# EAGLE schematic Bidirectional_Amp (EAGLE 9.5.1)

## Sheet 1 of 6: TX/RX Control
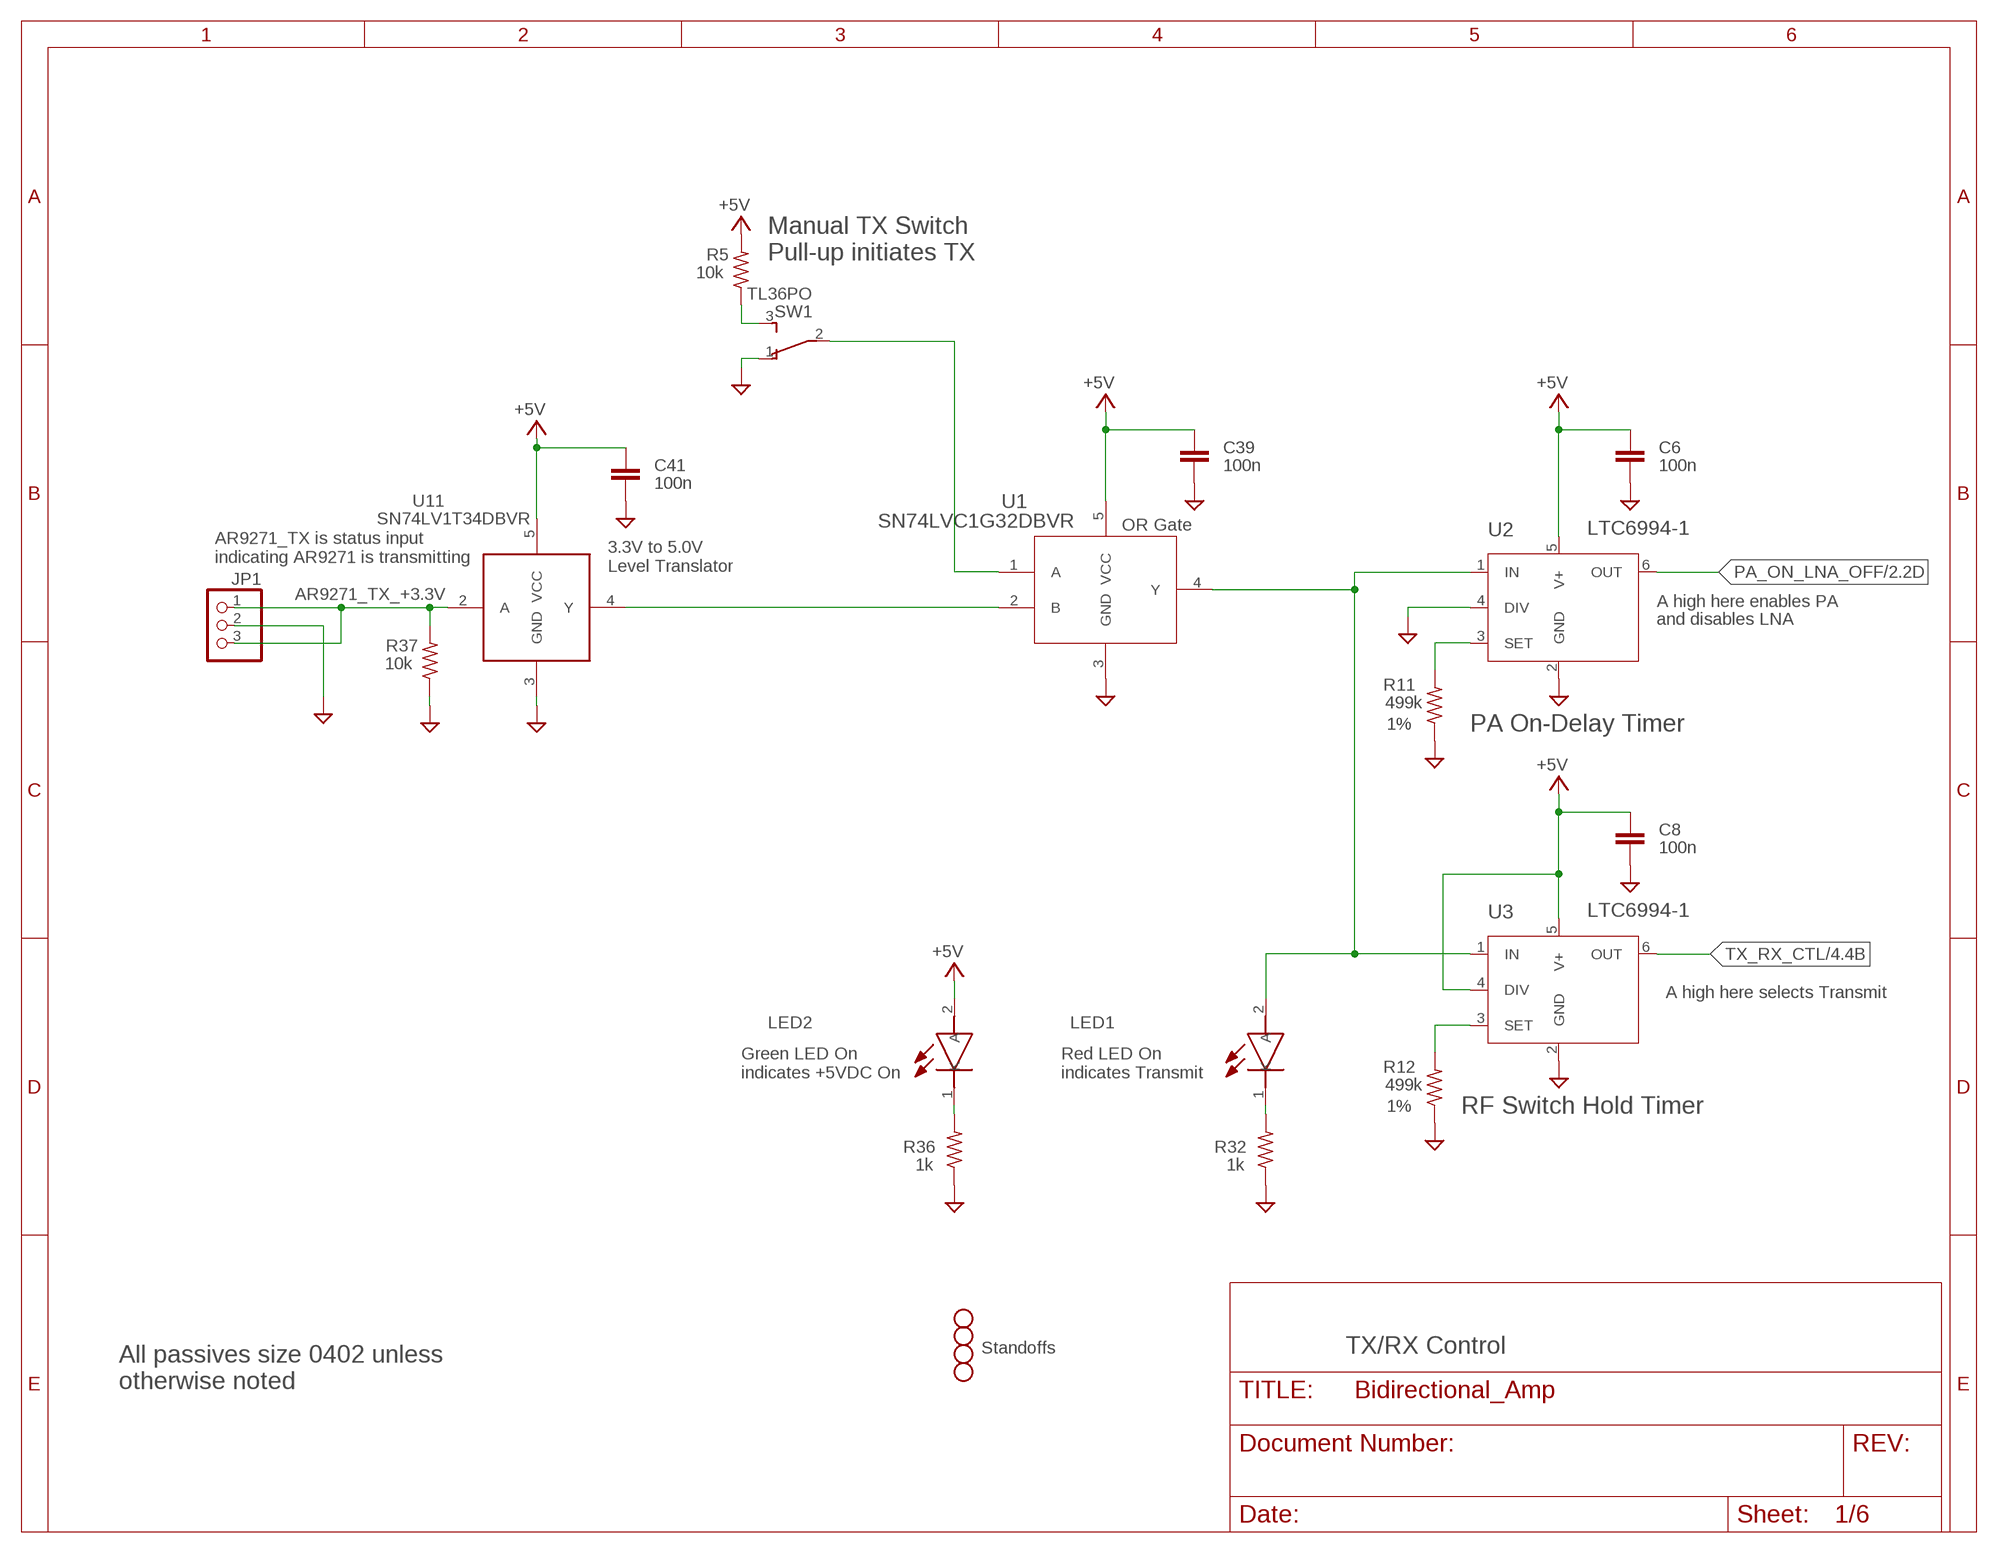
[diagram p0: schematic, sheet 1]

### Parts
C6  100n  C-EU0402-B-NOSILK  [.0402-B-NOSILK]
C8  100n  C-EU0402-B-NOSILK  [.0402-B-NOSILK]
C39  100n  C-EU0402-B-NOSILK  [.0402-B-NOSILK]
C41  100n  C-EU0402-B-NOSILK  [.0402-B-NOSILK]
H1  STAND-OFFTIGHT  [STAND-OFF-TIGHT]
H2  STAND-OFFTIGHT  [STAND-OFF-TIGHT]
H3  STAND-OFFTIGHT  [STAND-OFF-TIGHT]
H4  STAND-OFFTIGHT  [STAND-OFF-TIGHT]
JP1  PINHD-1X3  [1X03]
LED1  LTST-C193KRKT-5A  [LEDC1607X80N]
LED2  LTST-C193KGKT-5A  [LEDC1607X80N]
R5  10k  R-US_0402-B-NOSILK  [.0402-B-NOSILK]
R11  499k  R-US_0402-B-NOSILK  [.0402-B-NOSILK]
R12  499k  R-US_0402-B-NOSILK  [.0402-B-NOSILK]
R32  1k  R-US_0402-B-NOSILK  [.0402-B-NOSILK]
R36  1k  R-US_0402-B-NOSILK  [.0402-B-NOSILK]
R37  10k  R-US_0402-B-NOSILK  [.0402-B-NOSILK]
SW1  TL36PO  [TL3XPO]
U1  SN74LVC1G32DBVR  [DBV5]
U2  LTC6994-1  LTC6994CS6-1PBF  [TSOT-23_S6]
U3  LTC6994-1  LTC6994CS6-1PBF  [TSOT-23_S6]
U11  SN74LV1T34DBVR  [SOT95P280X145-5N]

### Nets
+5V: C6.1 C8.1 C39.1 C41.1 LED2.2(A) R5.2 U1.5(VCC) U2.5(V+) U3.4(DIV) U3.5(V+) U11.5(VCC) ; also sheet 2,3,4,5,6
AR9271_TX_+3.3V: JP1.1 JP1.3 R37.2 U11.2(A)
GND: C6.2 C8.2 C39.2 C41.2 JP1.2 R11.1 R12.1 R32.1 R36.1 R37.1 SW1.1(O) U1.3(GND) U2.2(GND) U2.4(DIV) U3.2(GND) U11.3(GND) ; also sheet 2,3,4,5,6
N$3: R5.1 SW1.3(S)
N$5: SW1.2(P) U1.1(A)
N$10: LED1.2(A) U1.4(Y) U2.1(IN) U3.1(IN)
N$11: R11.2 U2.3(SET)
N$13: U1.2(B) U11.4(Y)
N$14: R12.2 U3.3(SET)
N$15: LED1.1(K) R32.2
N$51: LED2.1(K) R36.2
PA_ON_LNA_OFF: U2.6(OUT) ; also sheet 2,3
TX_RX_CTL: U3.6(OUT) ; also sheet 4

### Notes on the sheet
- Manual TX Switch
  Pull-up initiates TX
- OR Gate
- AR9271_TX is status input
  indicating AR9271 is transmitting
- 3.3V to 5.0V
  Level Translator
- A high here enables PA
- and disables LNA
- 1% | PA On-Delay Timer
- A high here selects Transmit
- Green LED On
  indicates +5VDC On
- Red LED On
  indicates Transmit
- 1% | RF Switch Hold Timer
- Standoffs | TX/RX Control
- All passives size 0402 unless
  otherwise noted

## Sheet 2 of 6: Power Amplifier
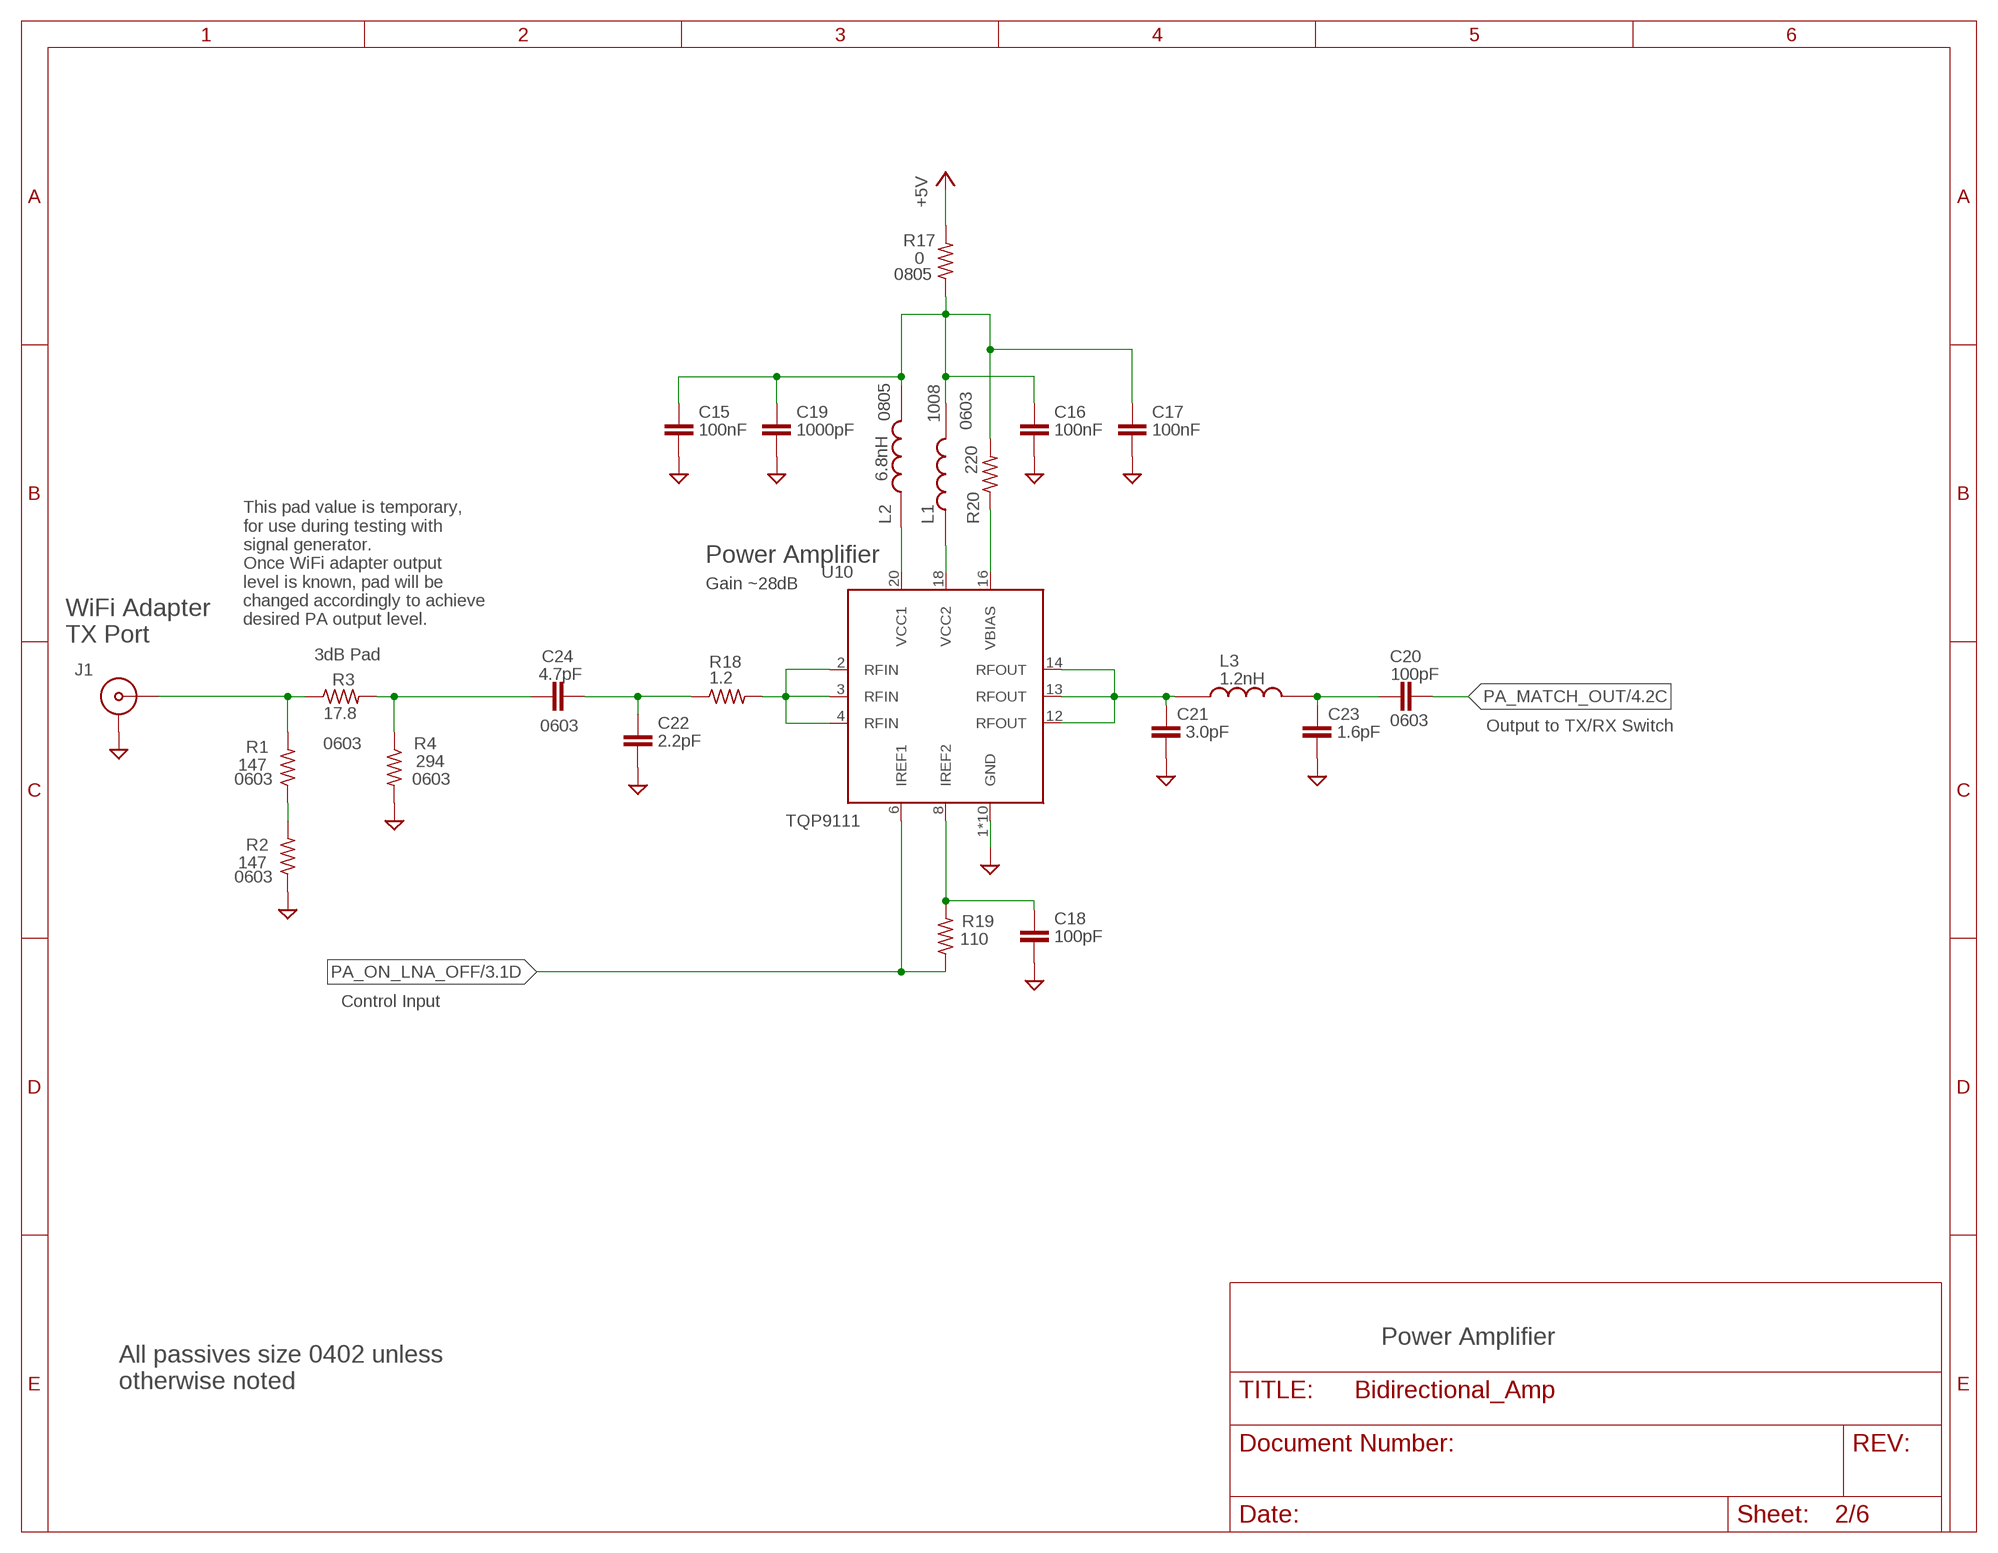
[diagram p1: schematic, sheet 2]

### Parts
C15  100nF  C-EU0402-B-NOSILK  [.0402-B-NOSILK]
C16  100nF  C-EU0402-B-NOSILK  [.0402-B-NOSILK]
C17  100nF  C-EU0402-B-NOSILK  [.0402-B-NOSILK]
C18  100pF  C-EU0402-B-NOSILK  [.0402-B-NOSILK]
C19  1000pF  C-EU0402-B-NOSILK  [.0402-B-NOSILK]
C20  100pF  C-EU0603-C-NOSILK  [.0603-C-NOSILK]
C21  3.0pF  C-EU0402-C-NOSILK  [.0402-C-NOSILK]
C22  2.2pF  C-EU0402-C-NOSILK  [.0402-C-NOSILK]
C23  1.6pF  C-EU0402-C-NOSILK  [.0402-C-NOSILK]
C24  4.7pF  C-EU0603-C-NOSILK  [.0603-C-NOSILK]
J1  142-0701-851_ALT  [142-0701-851]
L1  1008HQ-10NXJLB1008_IMPERIAL_2520_METRIC  [INDC2520X120N]
L2  6.8nH  0805CS-060XJLC  [0805CS]
L3  1.2nH  0402CS-1N2XJLW  [0402CS1N2XJLW]
R1  147  R-US_0603-C-NOSILK  [.0603-C-NOSILK]
R2  147  R-US_0603-C-NOSILK  [.0603-C-NOSILK]
R3  17.8  R-US_0603-C-NOSILK  [.0603-C-NOSILK]
R4  294  R-US_0603-C-NOSILK  [.0603-C-NOSILK]
R17  0  R-US_R0805  [R0805]
R18  1.2  R-US_R0402  [R0402]
R19  110  R-US_0402-B-NOSILK  [.0402-B-NOSILK]
R20  220  R-US_0603-C-NOSILK  [.0603-C-NOSILK]
U10  TQP9111  [QFN50P400X400X102-21N]

### Nets
+5V: R17.2 ; also sheet 1,3,4,5,6
GND: C15.2 C16.2 C17.2 C18.2 C19.2 C21.2 C22.2 C23.2 J1.GND1(GND) J1.GND2(GND) J1.GND3(GND) J1.GND4(GND) R2.1 R4.2 U10.1(GND) U10.5(GND) U10.7(GND) U10.9(GND) U10.10(GND) U10.11(GND) U10.15(GND) U10.17(GND) U10.19(GND) U10.21(GND) ; also sheet 1,3,4,5,6
N$2 [RF]: J1.RF1(CTR) R1.2 R3.1
N$4: R1.1 R2.2
N$16: L1.1 U10.18(VCC2)
N$21: C15.1 C16.1 C17.1 C19.1 L1.2 L2.2 R17.1 R20.2
N$22: C18.1 R19.2 U10.8(IREF2)
N$24 [RF]: C21.1 L3.1 U10.12(RFOUT) U10.13(RFOUT) U10.14(RFOUT)
N$25 [RF]: C22.1 C24.2 R18.1
N$27 [RF]: C20.1 C23.1 L3.2
N$30: R20.1 U10.16(VBIAS)
N$31: L2.1 U10.20(VCC1)
N$56 [RF]: R18.2 U10.2(RFIN) U10.3(RFIN) U10.4(RFIN)
PA_MATCH_OUT [RF]: C20.2 ; also sheet 4
PA_ON_LNA_OFF: R19.1 U10.6(IREF1) ; also sheet 1,3
PA_PAD_OUT [RF]: C24.1 R3.2 R4.1

### Notes on the sheet
- 0805
- 0805 | 1008
- 0603
- Power Amplifier
- Gain ~28dB
- This pad value is temporary,
  for use during testing with
  signal generator.
  Once WiFi adapter output
  level is known, pad will be
  changed accordingly to achieve
  desired PA output level.
- WiFi Adapter
  TX Port
- 3dB Pad
- 0603
- 0603 | Output to TX/RX Switch
- 0603
- 0603 | 0603
- 0603
- Control Input
- Power Amplifier
- All passives size 0402 unless
  otherwise noted

## Sheet 3 of 6: LNA and RX Bandpass Filters
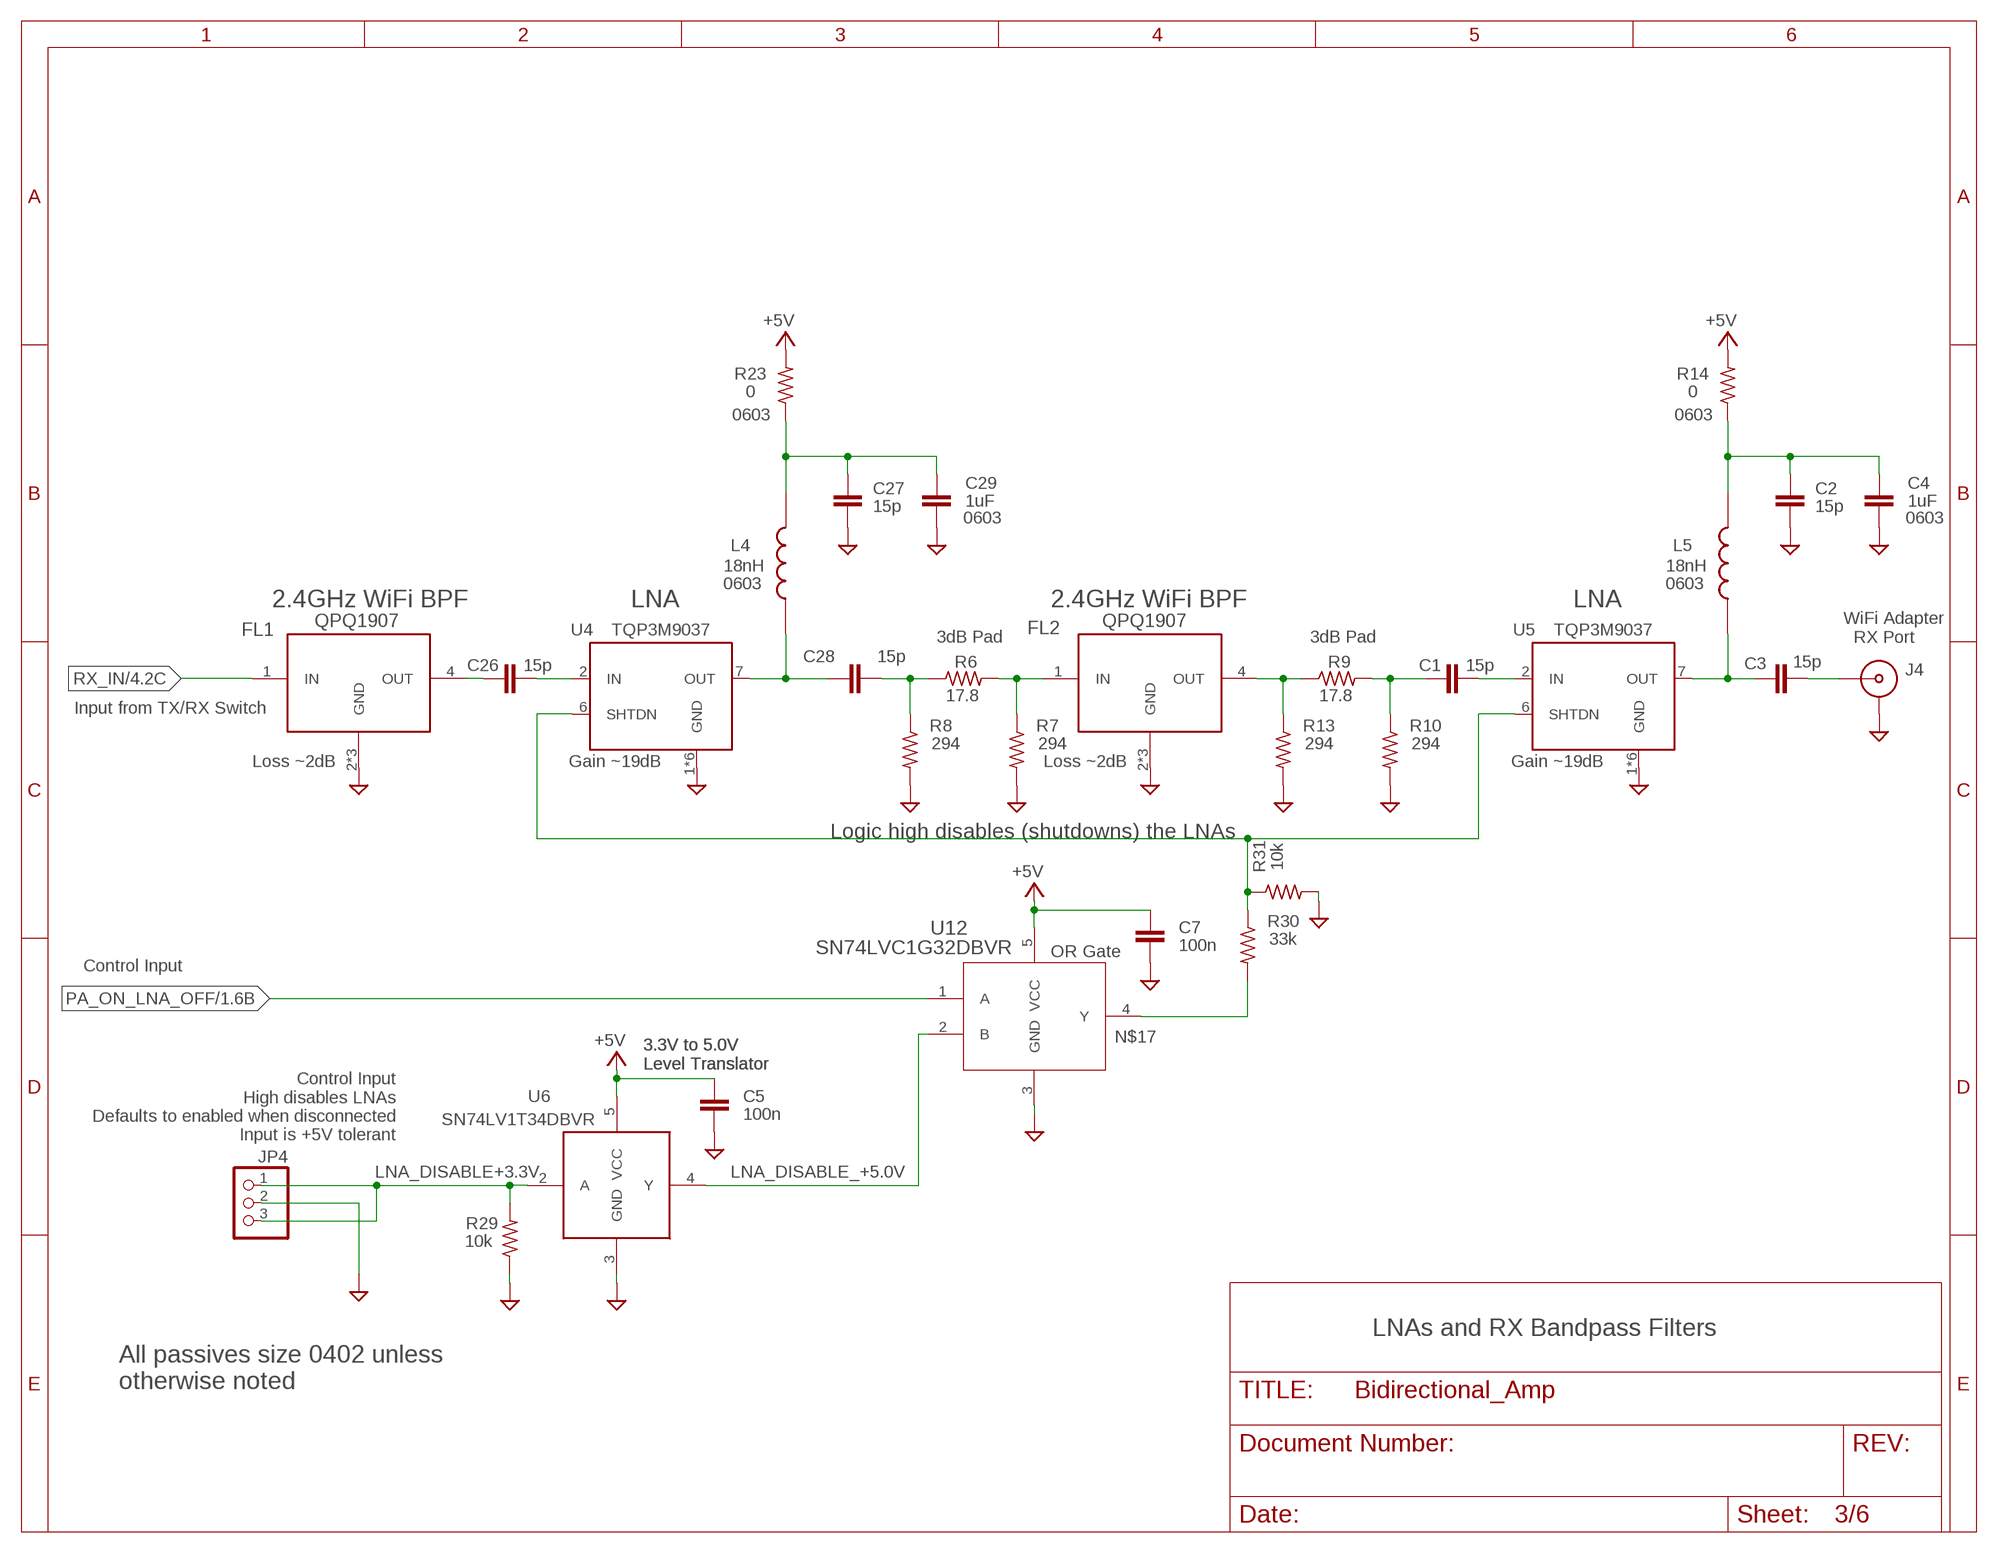
[diagram p2: schematic, sheet 3]

### Parts
C1  15p  C-EU0402-C-NOSILK  [.0402-C-NOSILK]
C2  15p  C-EU0402-B-NOSILK  [.0402-B-NOSILK]
C3  15p  C-EU0402-C-NOSILK  [.0402-C-NOSILK]
C4  1uF  C-EU0603-B-NOSILK  [.0603-B-NOSILK]
C5  100n  C-EU0402-B-NOSILK  [.0402-B-NOSILK]
C7  100n  C-EU0402-B-NOSILK  [.0402-B-NOSILK]
C26  15p  C-EU0402-C-NOSILK  [.0402-C-NOSILK]
C27  15p  C-EU0402-B-NOSILK  [.0402-B-NOSILK]
C28  15p  C-EU0402-C-NOSILK  [.0402-C-NOSILK]
C29  1uF  C-EU0603-B-NOSILK  [.0603-B-NOSILK]
FL1  QPQ1907  [FIL_B39162B9417K610]
FL2  QPQ1907  [FIL_B39162B9417K610]
J4  142-0701-851_ALT  [142-0701-851]
JP4  PINHD-1X3  [1X03]
L4  68nH  0603CS-68NXJLW  [0603CS-68NXJLW]
L5  68nH  0603CS-68NXJLW  [0603CS-68NXJLW]
R6  17.8  R-US_0402-C-NOSILK  [.0402-C-NOSILK]
R7  294  R-US_0402-C-NOSILK  [.0402-C-NOSILK]
R8  294  R-US_0402-C-NOSILK  [.0402-C-NOSILK]
R9  17.8  R-US_0402-C-NOSILK  [.0402-C-NOSILK]
R10  294  R-US_0402-C-NOSILK  [.0402-C-NOSILK]
R13  294  R-US_0402-C-NOSILK  [.0402-C-NOSILK]
R14  0  R-US_0603-B-NOSILK  [.0603-B-NOSILK]
R23  0  R-US_0603-B-NOSILK  [.0603-B-NOSILK]
R29  10k  R-US_0402-B-NOSILK  [.0402-B-NOSILK]
R30  33k  R-US_0402-B-NOSILK  [.0402-B-NOSILK]
R31  10k  R-US_0402-B-NOSILK  [.0402-B-NOSILK]
U4  TQP3M9037  TQP3M903X  [DFN8-2X2-WITH-PAD]
U5  TQP3M9037  TQP3M903X  [DFN8-2X2-WITH-PAD]
U6  SN74LV1T34DBVR  [SOT95P280X145-5N]
U12  SN74LVC1G32DBVR  [DBV5]

### Nets
+5V: C5.1 C7.1 R14.2 R23.2 U6.5(VCC) U12.5(VCC) ; also sheet 1,2,4,5,6
GND: C2.1 C4.2 C5.2 C7.2 C27.1 C29.2 FL1.2(GND) FL1.3(GND) FL1.5(GND) FL2.2(GND) FL2.3(GND) FL2.5(GND) J4.GND1(GND) J4.GND2(GND) J4.GND3(GND) J4.GND4(GND) JP4.2 R7.2 R8.2 R10.2 R13.2 R29.1 R31.2 U4.1(GND) U4.3(GND) U4.4(GND) U4.5(GND) U4.8(GND) U4.PAD(GND) U5.1(GND) U5.3(GND) U5.4(GND) U5.5(GND) U5.8(GND) U5.PAD(GND) U6.3(GND) U12.3(GND) ; also sheet 1,2,4,5,6
LNA_DISABLE+3.3V: JP4.1 JP4.3 R29.2 U6.2(A)
LNA_DISABLE_+5.0V: U6.4(Y) U12.2(B)
LNA_ON_OFF: R30.1 R31.1 U4.6(SHTDN) U5.6(SHTDN)
N$1 [RF]: C28.2 R6.1 R8.1
N$6 [RF]: FL2.4(OUT) R9.1 R13.1
N$7 [RF]: C1.2 U5.2(IN)
N$8 [RF]: C3.1 L5.1 U5.7(OUT)
N$9: C2.2 C4.1 L5.2 R14.1
N$12 [RF]: C3.2 J4.RF1(CTR)
N$17: R30.2 U12.4(Y)
N$26 [RF]: C26.2 U4.2(IN)
N$28 [RF]: C28.1 L4.1 U4.7(OUT)
N$29: C27.2 C29.1 L4.2 R23.1
N$33 [RF]: C26.1 FL1.4(OUT)
PA_ON_LNA_OFF: U12.1(A) ; also sheet 1,2
PA_PAD_OUT1 [RF]: FL2.1(IN) R6.2 R7.1
PA_PAD_OUT2 [RF]: C1.1 R9.2 R10.1
RX_IN [RF]: FL1.1(IN) ; also sheet 4

### Notes on the sheet
- 0603 | 0603
- 0603 | 0603
- 18nH | 18nH
- 0603 | 0603
- 2.4GHz WiFi BPF | LNA | 2.4GHz WiFi BPF | LNA
- 3dB Pad | 3dB Pad
- WiFi Adapter
    RX Port
- Input from TX/RX Switch
- Loss ~2dB | Gain ~19dB | Loss ~2dB | Gain ~19dB
- Logic high disables (shutdowns) the LNAs
- OR Gate
- Control Input
- 3.3V to 5.0V
  Level Translator
- 3.3V to 5.0V
  Level Translator
- Control Input
  High disables LNAs
  Defaults to enabled when disconnected
  Input is +5V tolerant
- LNAs and RX Bandpass Filters
- All passives size 0402 unless
  otherwise noted

## Sheet 4 of 6: TX/RX Switch
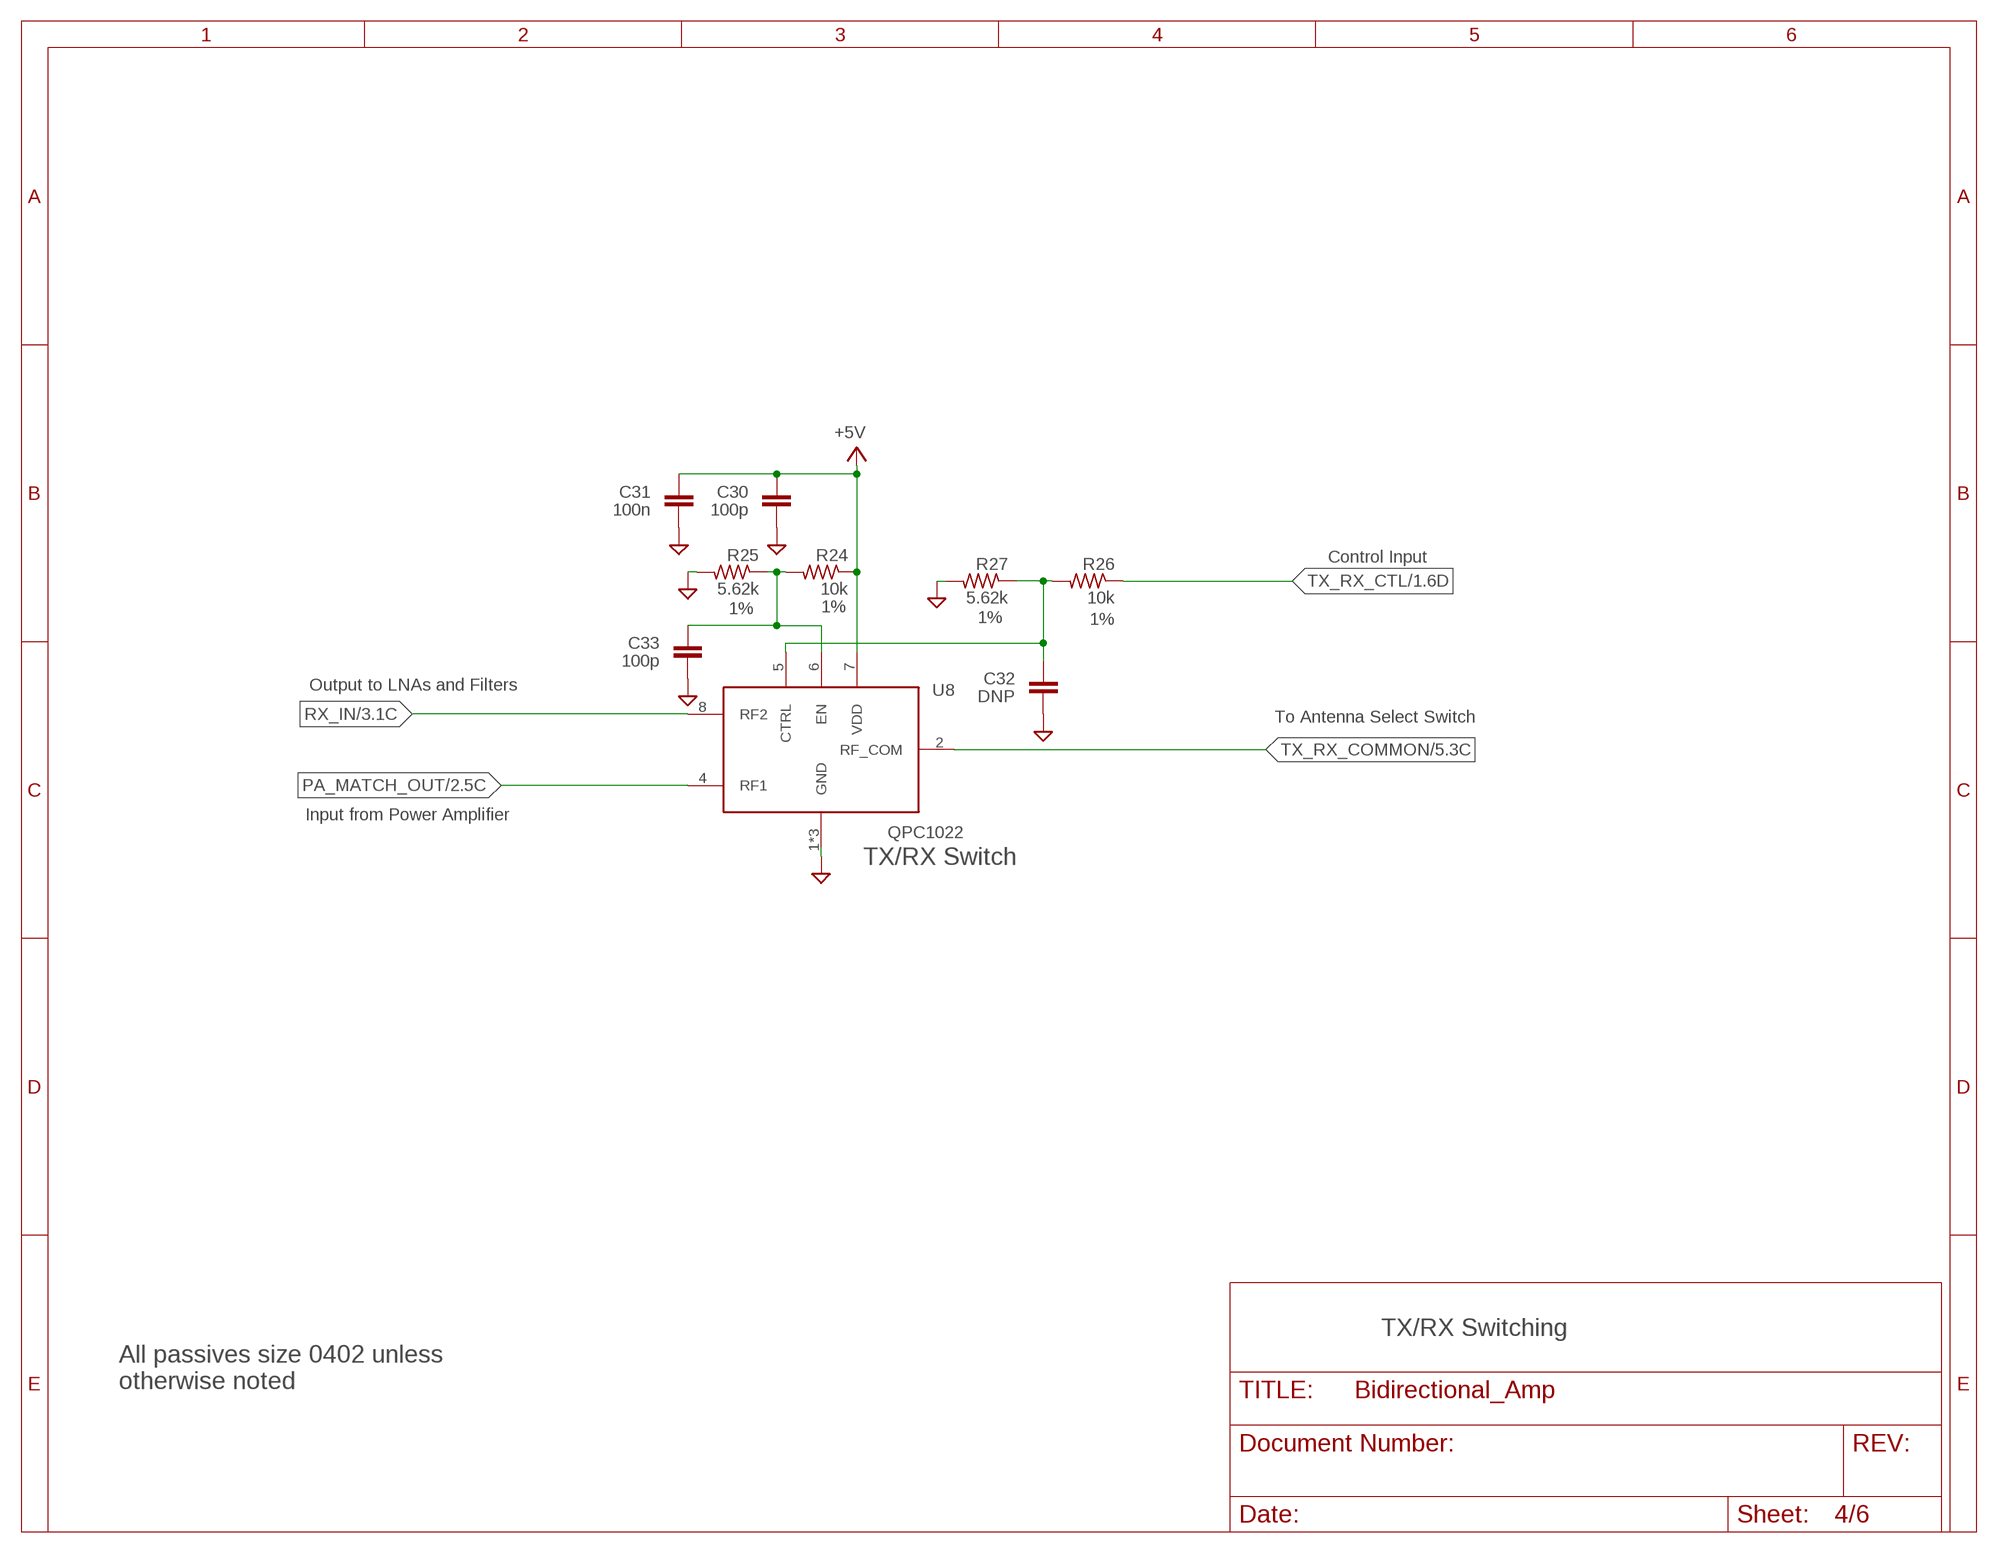
[diagram p3: schematic, sheet 4]

### Parts
C30  100p  C-EU0402-B-NOSILK  [.0402-B-NOSILK]
C31  100n  C-EU0402-B-NOSILK  [.0402-B-NOSILK]
C32  DNP  C-EU0402-B-NOSILK  [.0402-B-NOSILK]
C33  100p  C-EU0402-B-NOSILK  [.0402-B-NOSILK]
R24  10k  R-US_0402-B-NOSILK  [.0402-B-NOSILK]
R25  5.62k  R-US_0402-B-NOSILK  [.0402-B-NOSILK]
R26  10k  R-US_0402-B-NOSILK  [.0402-B-NOSILK]
R27  5.62k  R-US_0402-B-NOSILK  [.0402-B-NOSILK]
U8  QPC1022  [QPC1022]

### Nets
+5V: C30.1 C31.1 R24.1 U8.7(VDD) ; also sheet 1,2,3,5,6
GND: C30.2 C31.2 C32.2 C33.2 R25.2 R27.2 U8.1(GND) U8.3(GND) U8.9(GND) ; also sheet 1,2,3,5,6
PA_MATCH_OUT [RF]: U8.4(RF1) ; also sheet 2
RX_IN [RF]: U8.8(RF2) ; also sheet 3
TX_RX_COMMON [RF]: U8.2(RF_COM) ; also sheet 5
TX_RX_CTL: R26.1 ; also sheet 1
TXRX-CTRL: C32.1 R26.2 R27.1 U8.5(CTRL)
TXRX-EN: C33.1 R24.2 R25.1 U8.6(EN)

### Notes on the sheet
- Control Input
- 1% | 1%
- 1% | 1%
- Output to LNAs and Filters
- To Antenna Select Switch
- Input from Power Amplifier
- TX/RX Switch
- TX/RX Switching
- All passives size 0402 unless
  otherwise noted

## Sheet 5 of 6: Antenna Select Switch
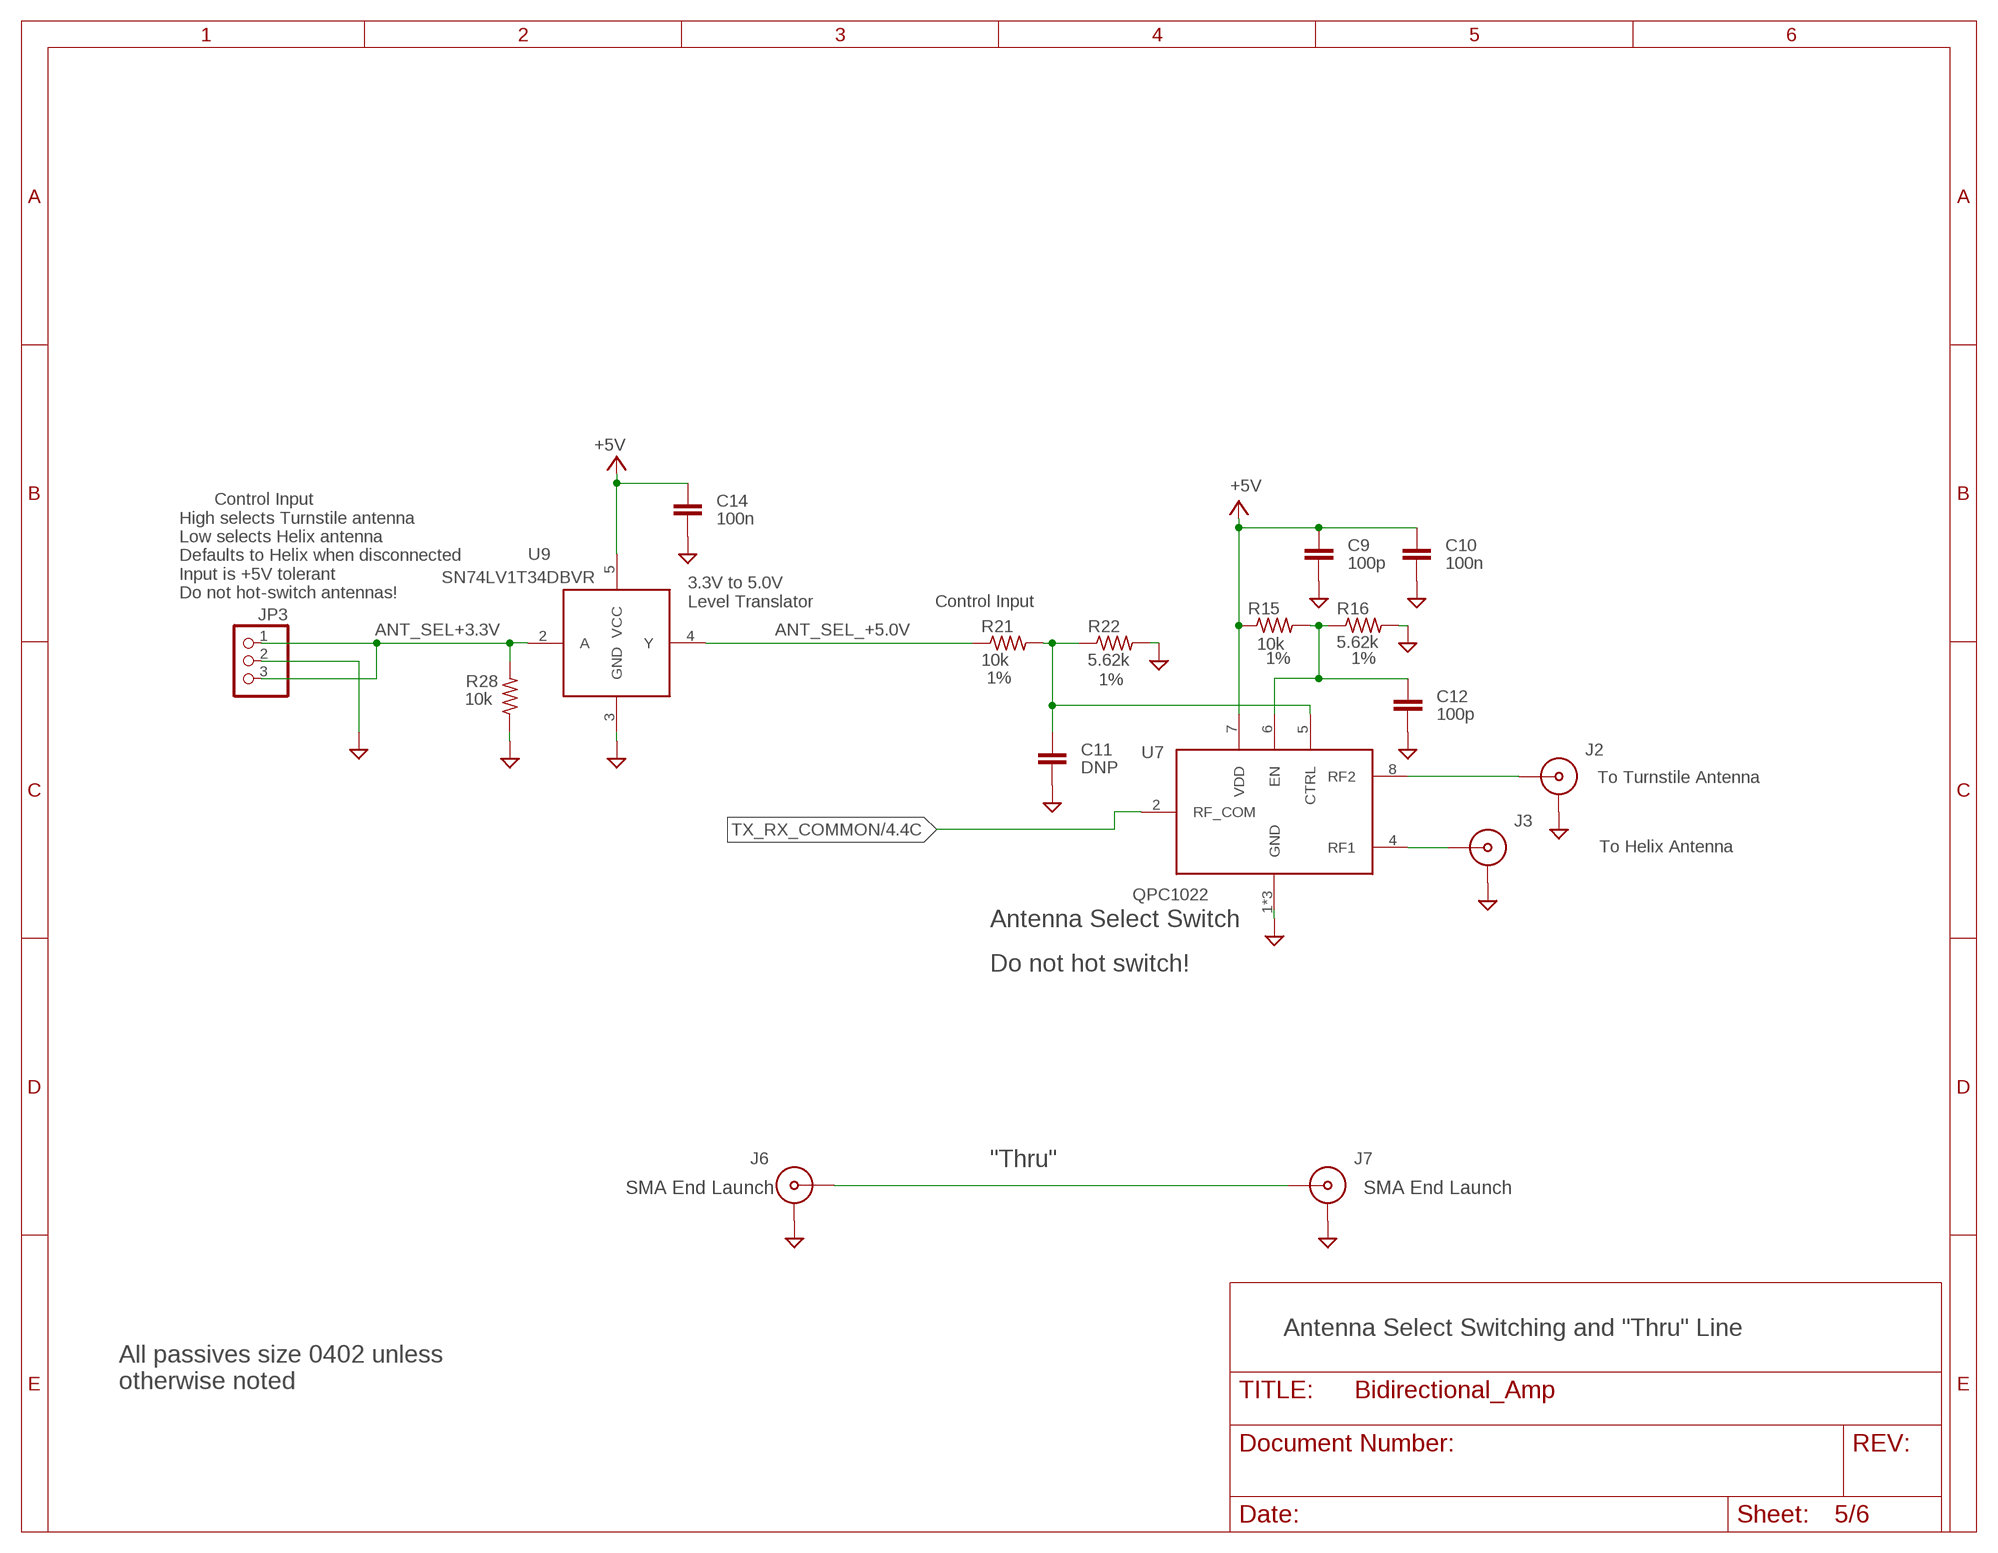
[diagram p4: schematic, sheet 5]

### Parts
C9  100p  C-EU0402-B-NOSILK  [.0402-B-NOSILK]
C10  100n  C-EU0402-B-NOSILK  [.0402-B-NOSILK]
C11  DNP  C-EU0402-B-NOSILK  [.0402-B-NOSILK]
C12  100p  C-EU0402-B-NOSILK  [.0402-B-NOSILK]
C14  100n  C-EU0402-B-NOSILK  [.0402-B-NOSILK]
J2  142-0701-851_ALT  [142-0701-851]
J3  142-0701-851_ALT  [142-0701-851]
J6  142-0701-851_ALT  [142-0701-851]
J7  142-0701-851_ALT  [142-0701-851]
JP3  PINHD-1X3  [1X03]
R15  10k  R-US_0402-B-NOSILK  [.0402-B-NOSILK]
R16  5.62k  R-US_0402-B-NOSILK  [.0402-B-NOSILK]
R21  10k  R-US_0402-B-NOSILK  [.0402-B-NOSILK]
R22  5.62k  R-US_0402-B-NOSILK  [.0402-B-NOSILK]
R28  10k  R-US_0402-B-NOSILK  [.0402-B-NOSILK]
U7  QPC1022  [QPC1022]
U9  SN74LV1T34DBVR  [SOT95P280X145-5N]

### Nets
+5V: C9.1 C10.1 C14.1 R15.1 U7.7(VDD) U9.5(VCC) ; also sheet 1,2,3,4,6
ANT_SEL+3.3V: JP3.1 JP3.3 R28.2 U9.2(A)
ANT_SEL_+5.0V: R21.1 U9.4(Y)
AS-CTRL: C11.1 R21.2 R22.1 U7.5(CTRL)
AS-EN: C12.1 R15.2 R16.1 U7.6(EN)
GND: C9.2 C10.2 C11.2 C12.2 C14.2 J2.GND1(GND) J2.GND2(GND) J2.GND3(GND) J2.GND4(GND) J3.GND1(GND) J3.GND2(GND) J3.GND3(GND) J3.GND4(GND) J6.GND1(GND) J6.GND2(GND) J6.GND3(GND) J6.GND4(GND) J7.GND1(GND) J7.GND2(GND) J7.GND3(GND) J7.GND4(GND) JP3.2 R16.2 R22.2 R28.1 U7.1(GND) U7.3(GND) U7.9(GND) U9.3(GND) ; also sheet 1,2,3,4,6
HELICAL [RF]: J2.RF1(CTR) U7.8(RF2)
THROUGH [RF]: J6.RF1(CTR) J7.RF1(CTR)
TURNSTILE [RF]: J3.RF1(CTR) U7.4(RF1)
TX_RX_COMMON [RF]: U7.2(RF_COM) ; also sheet 4

### Notes on the sheet
- Control Input
  High selects Turnstile antenna
  Low selects Helix antenna
  Defaults to Helix when disconnected
  Input is +5V tolerant
  Do not hot-switch antennas!
- 3.3V to 5.0V
  Level Translator
- Control Input
- 1% | 1%
- 1% | 1%
- To Turnstile Antenna
- To Helix Antenna
- Antenna Select Switch
- Do not hot switch!
- "Thru"
- SMA End Launch | SMA End Launch
- Antenna Select Switching and "Thru" Line
- All passives size 0402 unless
  otherwise noted

## Sheet 6 of 6: Power
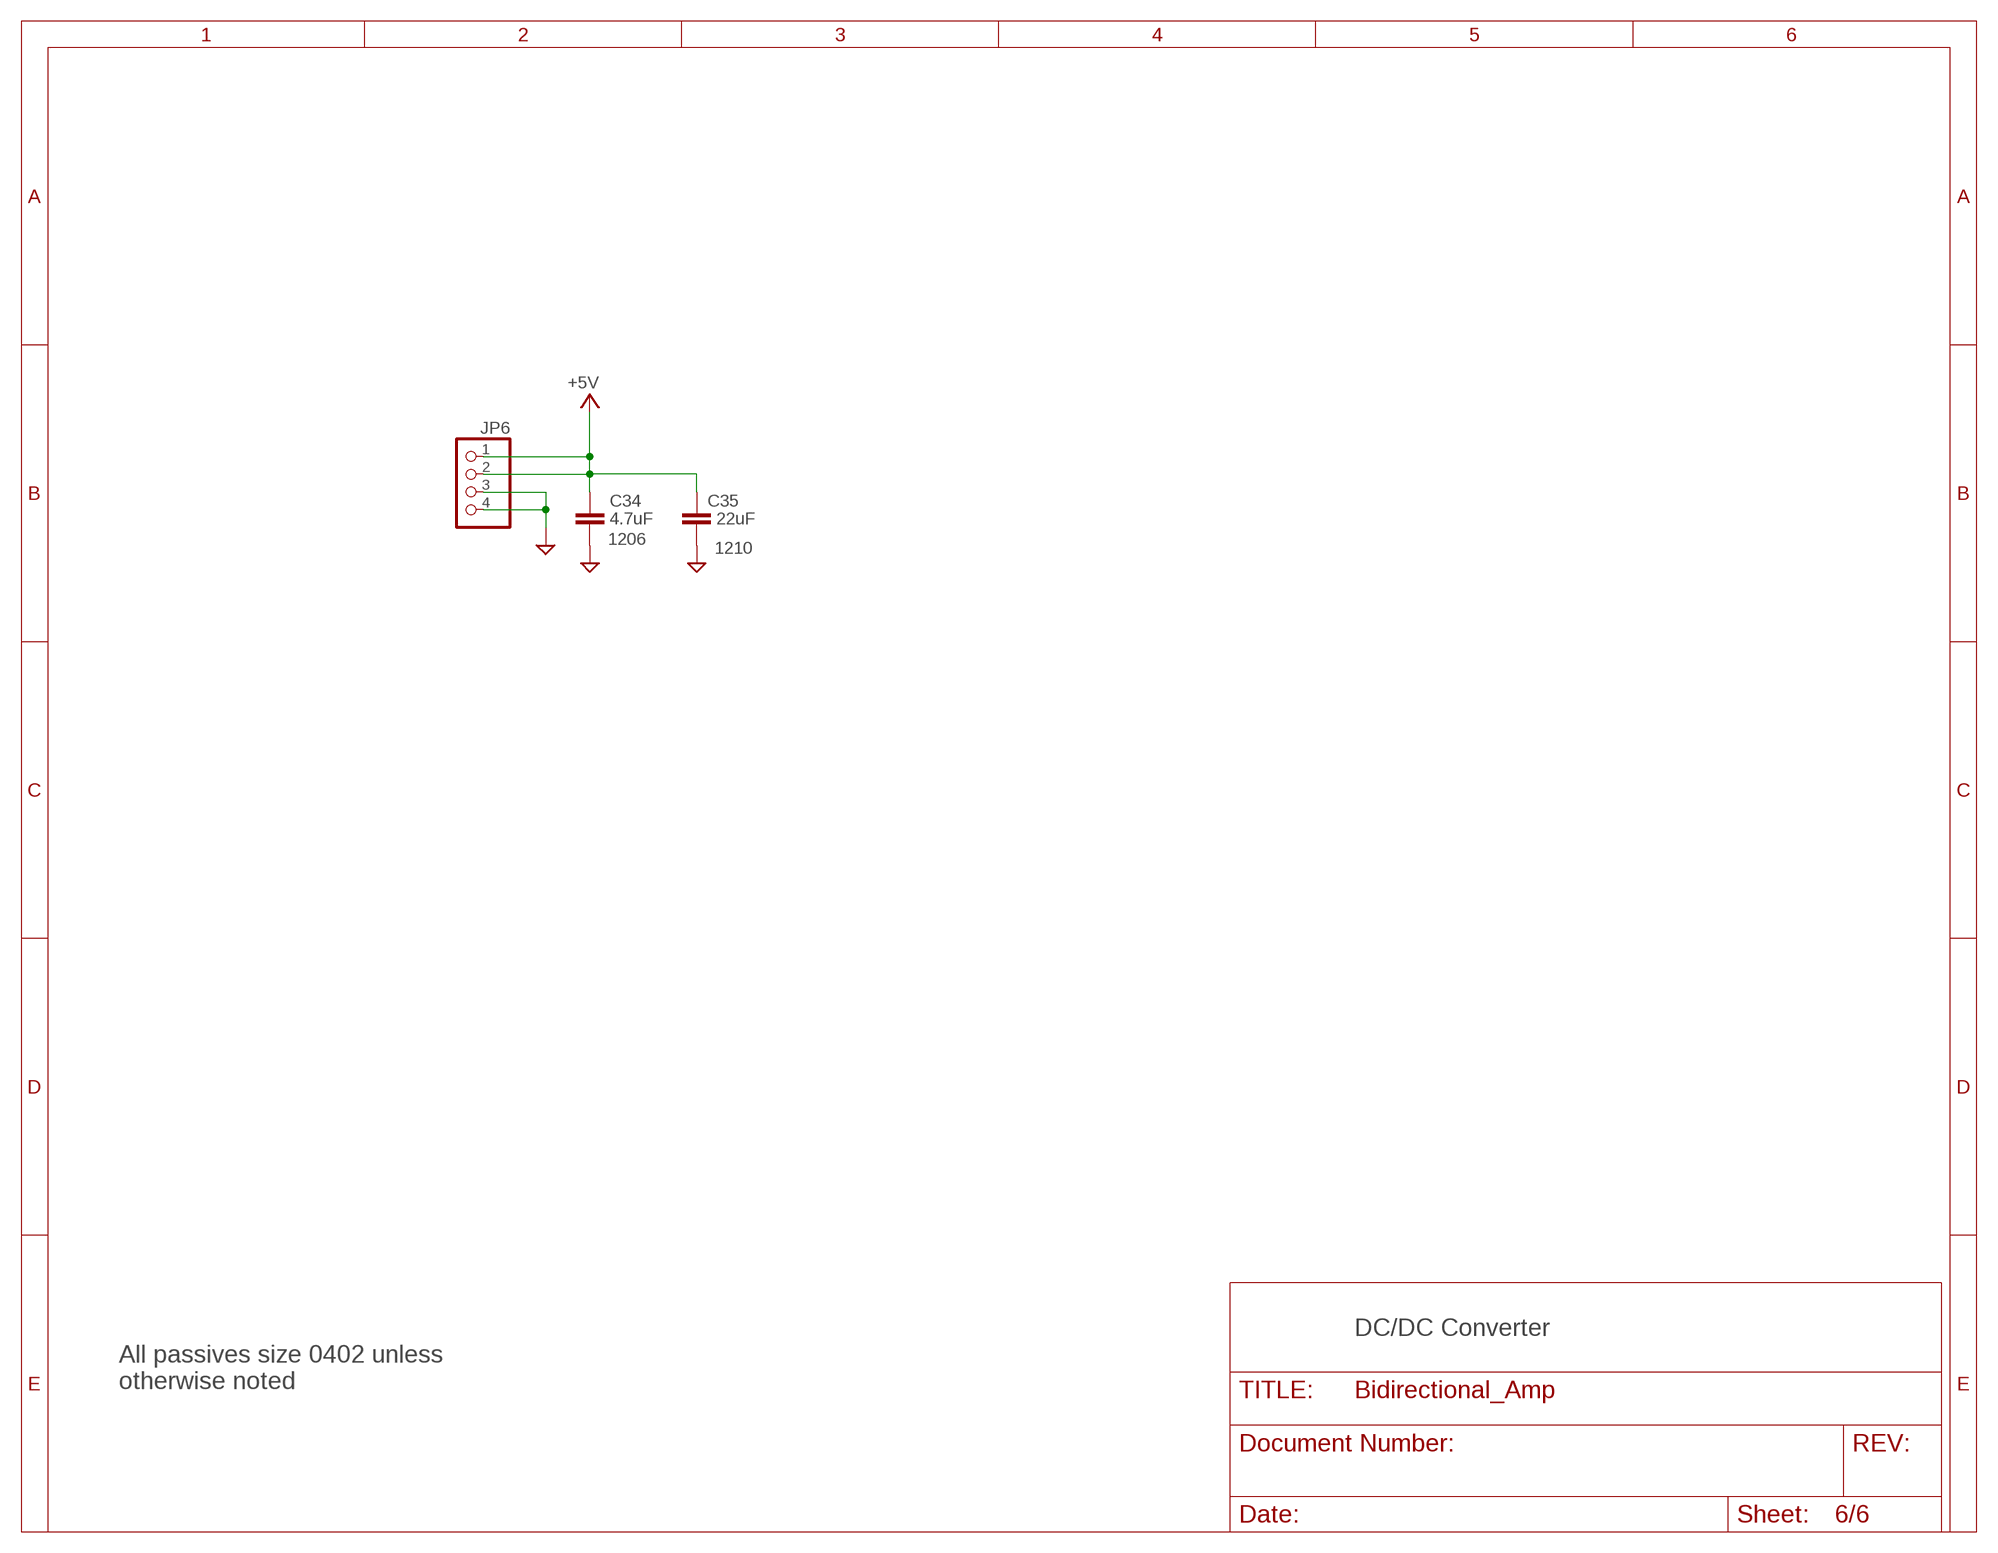
[diagram p5: schematic, sheet 6]

### Parts
C34  4.7uF  C-EUC1206  [C1206]
C35  22uF  C-EUC1210  [C1210]
JP6  PINHD-1X4  [1X04]

### Nets
+5V: C34.1 C35.1 JP6.1 JP6.2 ; also sheet 1,2,3,4,5
GND: C34.2 C35.2 JP6.3 JP6.4 ; also sheet 1,2,3,4,5

### Notes on the sheet
- 1206
- 1210
- DC/DC Converter
- All passives size 0402 unless
  otherwise noted

## Library data of the parts
C1-C3 C26-C28 = oresat-rcl:C-EU: CAPACITOR, European symbol; MFR: Murata; MPN: GJM1555C1H150JB01D
C4 C29 = oresat-rcl:C-EU: CAPACITOR, European symbol; MFR: KEMET; MPN: C0603X105M4RACAUTO
C5 C10 C14 C31 = oresat-rcl:C-EU: CAPACITOR, European symbol; MFR: TDK Corporation; MPN: CGA2B1X7R1C104K050BC
C6-C8 C15-C17 C39 C41 = oresat-rcl:C-EU: CAPACITOR, European symbol; MFR: TDK; MPN: CGA2B1X7R1C104K050BC
C9 C18 C30 C33 = oresat-rcl:C-EU: CAPACITOR, European symbol; MFR: Murata; MPN: GCM1555C1H101JA16D
C11 C12 = oresat-rcl:C-EU: CAPACITOR, European symbol; MPN: GCM1555C1H101JA16D
C19 = oresat-rcl:C-EU: CAPACITOR, European symbol; MFR: TDK; MPN: CGA2B2NP01H102J050BA
C20 = oresat-rcl:C-EU: CAPACITOR, European symbol; MFR: Murata; MPN: GCM1885C1H101JA16D
C21 = oresat-rcl:C-EU: CAPACITOR, European symbol; MFR: Taiyo Yuden; MPN: UVK105CG030JW-F
C22 = oresat-rcl:C-EU: CAPACITOR, European symbol; MFR: Taiyo Yuden; MPN: UVK105CG2R2JW-F
C23 = oresat-rcl:C-EU: CAPACITOR, European symbol; MFR: Murata; MPN: GJM1555C1H1R6BB01D
C24 = oresat-rcl:C-EU: CAPACITOR, European symbol; MFR: AVX Corp.; MPN: 06032U4R7BAT2A
C32 = oresat-rcl:C-EU: CAPACITOR, European symbol
C34 = rcl:C-EU: CAPACITOR, European symbol; MFR: Murata; MPN: GCJ31CR71C475KA01L; SIZE: 1206; SPICEPREFIX: C; VOLTAGE: 16V
C35 = rcl:C-EU: CAPACITOR, European symbol; MFR: Murata; MPN: GCJ32ER71C226KE01L; SPICEPREFIX: C
FL1 FL2 = U-Qorvo-QPQ1907-2.4GHz-BPF:QPQ1907: 2.4GHz BPF; MFR: Qorvo; MPN: QPQ1907
H1-H4 = SparkFun-Hardware:STAND-OFF: Stand Off Drill holes for mechanically mounting via screws, standoffs, etc. Note: Use the keepout ring to avoid running the screw head into surrounding components. Variant Overviews STAND-OFF - Mechanical footprint for a #4 phillips button head screw. STAND-OFF-TIGHT - Mechanical footprint for a #4 phillips button head screw, Example SparkFun Products Screw - Phillips Head (1/4", 4-40, 10 pack) <https://www.sparkfun.com/products/10453> (PRT-10453) Screw - Phillips Head (1/2", 4-40, 10 pack) <https://www.sparkfun.com/products/10452> (PRT-10452) Screw - Phillips Head (3/4", 4-40, 10 pack) <https://www.sparkfun.com/products/10451> (PRT-10451) Screw - Phillips Head (1", 4-40, 10 pack) <https://www.sparkfun.com/products/10450> (PRT-10450)
J1-J4 J6 J7 = J-Cinch-142-0701-851-SMA-end-launch:142-0701-851_ALT: SMA Jack 50Ω - End Launch This is a more common symbol for coax connectors; MFR: Cinch; MPN: 142-0701-851
JP1 JP3 JP4 = pinhead:PINHD-1X3: PIN HEADER; MFR: Molex; MPN: 22-23-2031
JP6 = pinhead:PINHD-1X4: PIN HEADER
L1 = SamacSys_Parts:1008HQ-10NXJLB: Fixed Inductors 1008HQ 10 nH 5 % 1.6 A; MFR: COILCRAFT; MPN: 1008HQ-10NXJLB
L2 = SamacSys_Parts:0805CS-060XJLC: Fixed Inductors 0805CS Ceramic Chip 6.8 nH 5 % 0.6 A; DESCRIPTION: Fixed Inductors 0805CS Ceramic Chip 6.8 nH 5 % 0.6 A; HEIGHT: mm; MFR: COILCRAFT; MPN: 0805CS-060XJLC
L3 = SamacSys_Parts:0402CS-1N2XJLW: RF inductor, ceramic core, 5% tol, SMT, RoHS, halogen-free Source: Datasheet <https://www.coilcraft.com/misc/0402csd.html>; DESCRIPTION: RF inductor, ceramic core, 5% tol, SMT, RoHS, halogen-free; HEIGHT: 0mm; MFR: COILCRAFT; MPN: 0402CS-1N2XJLW
L4 L5 = SamacSys_Parts:0603CS-68NXJLW: Fixed Inductors 0603CS High Q, 68nH 0.6A Source: Datasheet <https://www.coilcraft.com/pdfs/0603cs.pdf>; HEIGHT: 1mm; MFR: COILCRAFT; MPN: 0603CS-18NXJLW
LED1 = SamacSys_Parts:LTST-C193KRKT-5A: LED,SMD,0603,Red, Lite-On LTST-C193KRKT-5A Red LED, 631 nm, 1608 (0603), Rectangle Lens SMD Package Source: Datasheet <http://docs-europe.electrocomponents.com/webdocs/0dc0/0900766b80dc02a7.pdf>; DESCRIPTION: LED,SMD,0603,Red,Lite-On 1608 (0603), Rectangle Lens SMD Package; MFR: Lite-On; MPN: LTST-C193KRKT-5A
LED2 = SamacSys_Parts:LTST-C193KGKT-5A: LED,SMD,0603,Green, Lite-On LTST-C193KGKT-5A 1608 (0603), Rectangle Lens SMD Package Source: Datasheet <http://docs-europe.electrocomponents.com/webdocs/0dc0/0900766b80dc02a7.pdf>; DESCRIPTION: LED,SMD,0603,Green,Lite-On 1608 (0603), Rectangle Lens SMD Package; MFR: Lite-On; MPN: LTST-C193KGKT-5A
R1 R2 = oresat-rcl:R-US_: RESISTOR, American symbol; MFR: Panasonic; MPN: ERJ-3EKF1470V
R3 = oresat-rcl:R-US_: RESISTOR, American symbol; MFR: Panasonic; MPN: ERJ-3EKF17R8V
R4 = oresat-rcl:R-US_: RESISTOR, American symbol; MFR: Panasonic; MPN: ERJ-3EKF2940V
R5 R28 R29 R37 = oresat-rcl:R-US_: RESISTOR, American symbol; MFR: Panasonic; MPN: ERJ-2GEJ103X
R6 R9 = oresat-rcl:R-US_: RESISTOR, American symbol; MFR: Panasonic; MPN: ERJ-2RKF17R8X
R7 R8 R10 R13 R30 R31 = oresat-rcl:R-US_: RESISTOR, American symbol; MFR: Panasonic; MPN: ERJ-2RKF2940X
R11 R12 = oresat-rcl:R-US_: RESISTOR, American symbol; MFR: Panasonic; MPN: ERJ-2RKF4993X
R14 R23 = oresat-rcl:R-US_: RESISTOR, American symbol; MFR: Panasonic; MPN: ERJ-3GEY0R00V
R15 R21 R24 R26 = oresat-rcl:R-US_: RESISTOR, American symbol; MFR: Panasonic; MPN: ERJ-2RKF1002X
R16 R22 R25 R27 = oresat-rcl:R-US_: RESISTOR, American symbol; MFR: Panasonic; MPN: ERJ-2RKF5621X
R17 = rcl:R-US_: RESISTOR, American symbol; MFR: Panasonic; MPN: ERJ-6GEY0R00V; SPICEPREFIX: R
R18 = rcl:R-US_: RESISTOR, American symbol; MFR: Panasonic; MPN: ERJ-2GEJ1R2X; SPICEPREFIX: R
R19 = oresat-rcl:R-US_: RESISTOR, American symbol; MFR: Panasonic; MPN: ERJ-2RKF1100X
R20 = oresat-rcl:R-US_: RESISTOR, American symbol; MFR: Panasonic; MPN: ERJ-3EKF2200V
R32 R36 = oresat-rcl:R-US_: RESISTOR, American symbol; MFR: Panasonic; MPN: ERJ-2GEJ102X
SW1 = switch:TL36PO: TINY SWITCH ON - ON Source: http://www2.produktinfo.conrad.com/datenblaetter/700000-724999/705152-da-01-de-Subminiaturschalter_TL_36YO.pdf; MFR: APEM Inc.; MPN: TL36P005000
U1 U12 = SN74LVC1G32DBVR:SN74LVC1G32DBVR; MFR: Texas Instruments; MPN: SN74LVC1G32DBVR
U2 U3 = U-Linear-LTC6994CS6-1-programable-delay:LTC6994CS6-1PBF; MFR: Linear Technology; MPN: LTC6994-1
U4 U5 = U-Qorvo-TQP3M903x-LNA:TQP3M903X: Ultra Low Noise, High Linearity LNAs TQP3M9035: 0.05 - 6.0 GHz Operational Bandwidth Source: Datasheet <https://www.qorvo.com/products/p/TQP3M9035> TQP3M9036: 0.1 - 2.0 GHz Operational Bandwidth Source: Datasheet <https://www.qorvo.com/products/p/TQP3M9036> TQP3M9037: 0.7 - 6.0 GHz Operational Bandwidth Source: Datasheet <https://www.qorvo.com/products/p/TQP3M9037>; MFR: Qorvo; MPN: TQP3M9037
U6 U9 U11 = SamacSys_Parts:SN74LV1T34DBVR: Single Power Supply BUFFER Logic Level Shifter (no enable) Source: Datasheet <http://www.ti.com/lit/gpn/sn74lv1t34>; DESCRIPTION: Single Power Supply BUFFER Logic Level Shifter (no enable); MFR: Texas Instruments; MPN: SN74LV1T34DBVR
U7 U8 = U-Qorvo-QPC1022-RF-SPDT-switch:QPC1022; MFR: Qorvo; MPN: QPC1022
U10 = oresat-samacsys_Parts:TQP9111: RF Amplifier 1.8-2.7GHz Gn 29.8dB P1dB 32.5dBm 2 stage Source: Datasheet <https://componentsearchengine.com/Datasheets/1/TQP9111.pdf>; DESCRIPTION: RF Amplifier 1.8-2.7GHz Gn 29.8dB P1dB 32.5dBm 2 stage; HEIGHT: 1.02mm; MFR: Qorvo; MPN: TQP9111

## Net classes
1 RF: clearance 0.75 mm